# EAGLE design blinker_schematic (EAGLE 7.4.0)
Blinkersteuerung
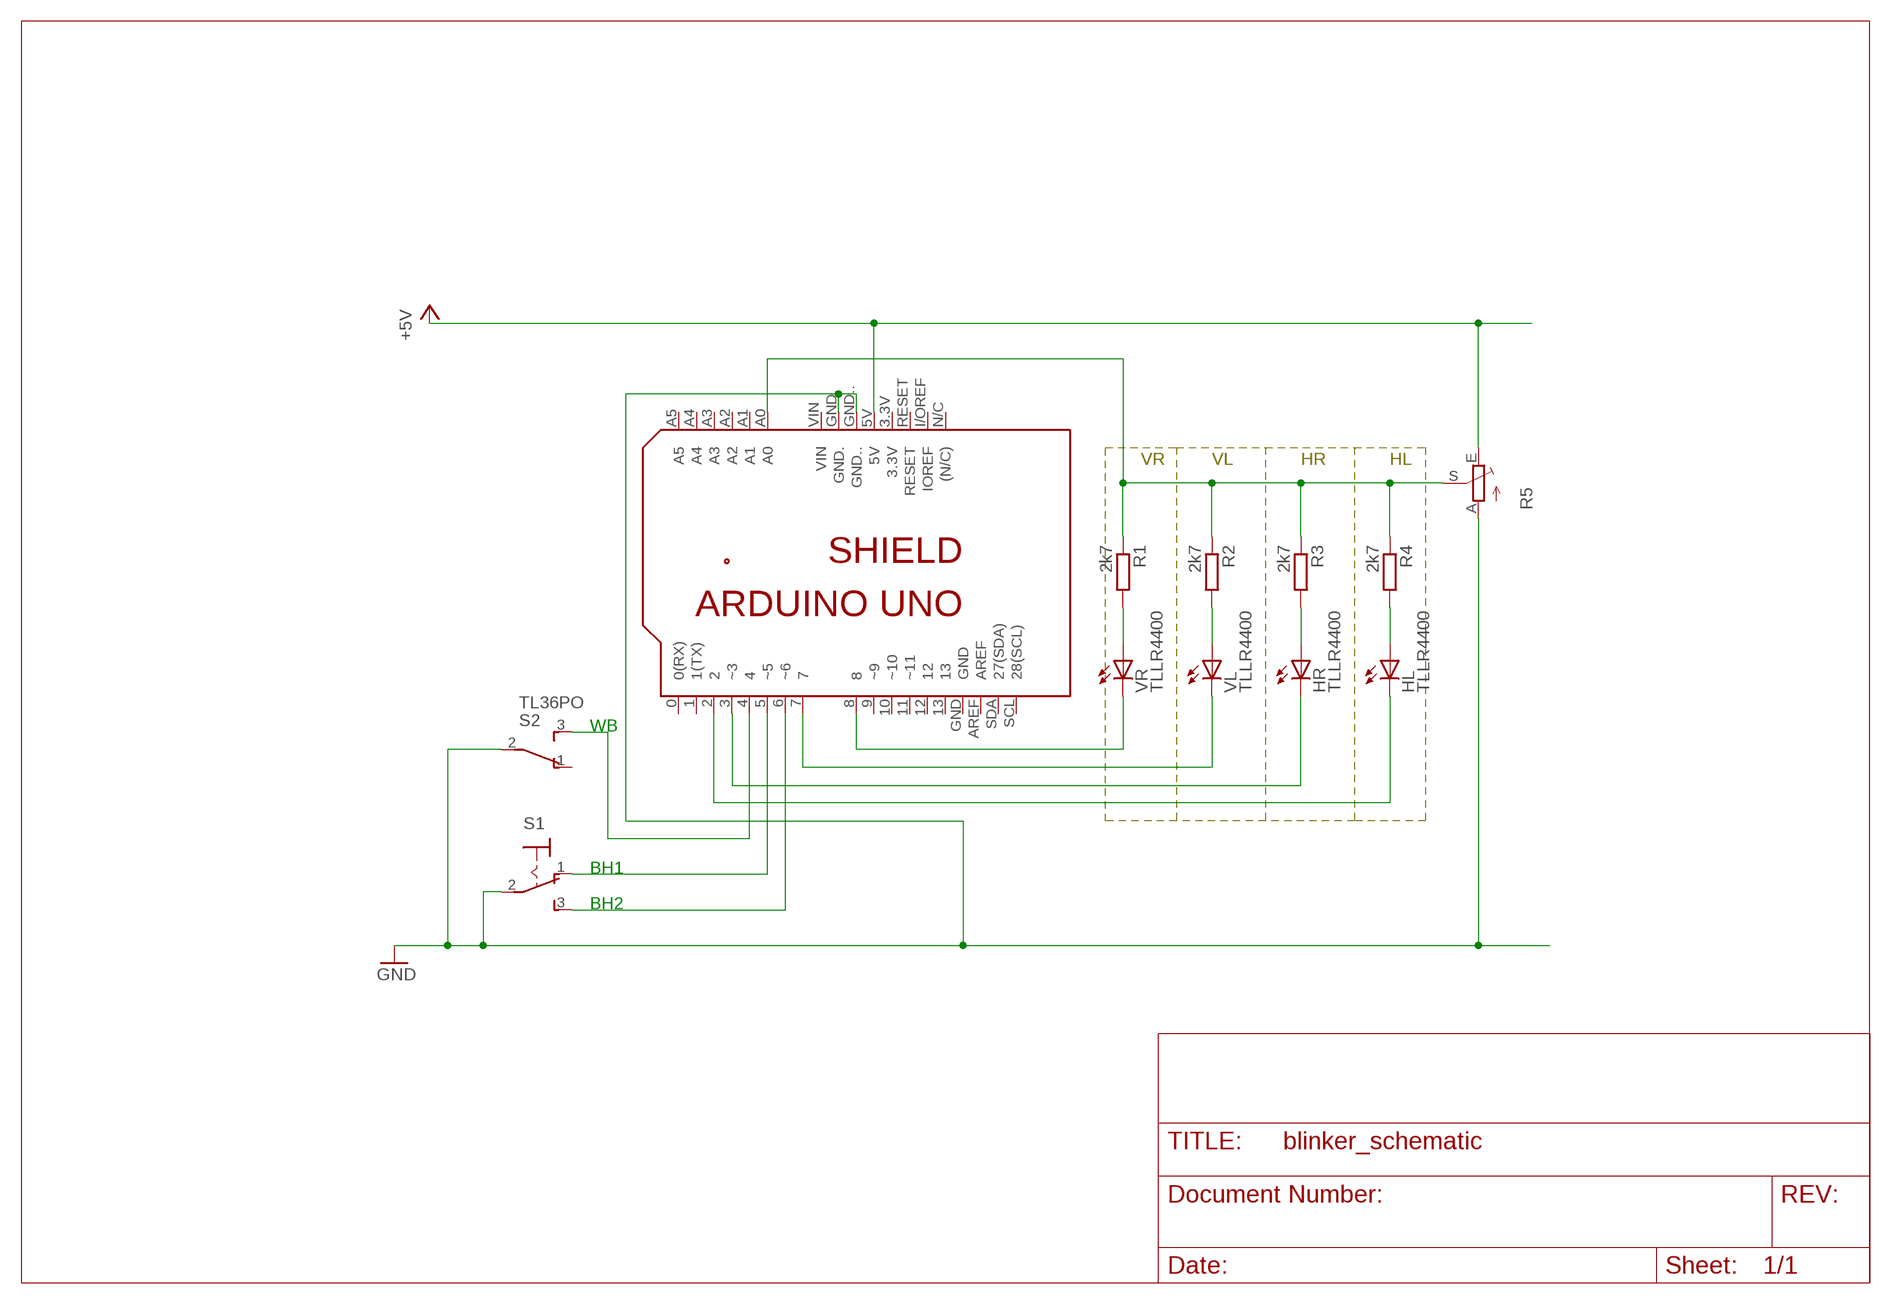
[diagram p0: schematic, sheet 1]

## Parts
HL  TLLR4400  [LED3MM]
HR  TLLR4400  [LED3MM]
PCB1  ARDUINO_UNO  [ARDUINO_UNO]
R1  2k7  R-EU_0207/12  [0207/12]
R2  2k7  R-EU_0207/12  [0207/12]
R3  2k7  R-EU_0207/12  [0207/12]
R4  2k7  R-EU_0207/12  [0207/12]
R5  TRIM_EU-RS3  [RS3]
S1  M9040P  [M9040P]
S2  TL36PO  [TL3XPO]
VL  TLLR4400  [LED3MM]
VR  TLLR4400  [LED3MM]

## Nets
+5V: PCB1.5V R5.E
GND: PCB1.GND. PCB1.GND.. R5.A S1.2(P) S2.2(P)
N$1: PCB1.A0 R1.1 R2.1 R3.1 R4.1 R5.S
N$2: R1.2 VR.A
N$3: R2.2 VL.A
N$4: HR.A R3.2
N$5: HL.A R4.2
N$8: PCB1.8 VR.K(C)
N$9: PCB1.7 VL.K(C)
N$10: PCB1.6(~6) S1.3(S)
N$11: PCB1.5(~5) S1.1(O)
N$12: PCB1.4 S2.3(S)
N$13: HR.K(C) PCB1.3(~3)
N$14: HL.K(C) PCB1.2
Unconnected: PCB1.0(0(RX)) PCB1.1(1(TX)) PCB1.3.3V PCB1.9(~9) PCB1.10(~10) PCB1.11(~11) PCB1.12 PCB1.13 PCB1.A1 PCB1.A2 PCB1.A3 PCB1.A4 PCB1.A5 PCB1.AREF PCB1.GND PCB1.I/OREF(IOREF) PCB1.N/C((N/C)) PCB1.RESET PCB1.SCL(28(SCL)) PCB1.SDA(27(SDA)) PCB1.VIN S2.1(O)

## Notes on the sheet
- VR | VL | HR | HL
- WB
- BH1
- BH2

## Library data of the parts
HL HR VL VR = HSKA_SWEWS16:TLLR4400: Low Current (2mA) LED 3 mm Tinted Diffused Package color RED Source: Data sheet <http://www.farnell.com/datasheets/391100.pdf>; MF: VISHAY SEMICONDUCTOR; OC_FARNELL: 1612437
PCB1 = HSKA_SWEWS16:ARDUINO_UNO: Device for representing an Arduino Uno board with a footprint in an EAGLE design. Created by Dave Young for Element14. More EAGLE documentation at: http://www.element14.com/community/community/knode/cadsoft_eagle
R1-R4 = HSKA_SWEWS16:R-EU_: RESISTOR, European symbol
R5 = HSKA_SWEWS16:TRIM_EU-: POTENTIOMETER
S1 = HSKA_SWEWS16:M9040P: TOGGLE SWITCH Marquardt
S2 = HSKA_SWEWS16:TL36PO: TINY SWITCH ON - ON Source: http://www2.produktinfo.conrad.com/datenblaetter/700000-724999/705152-da-01-de-Subminiaturschalter_TL_36YO.pdf

## Board
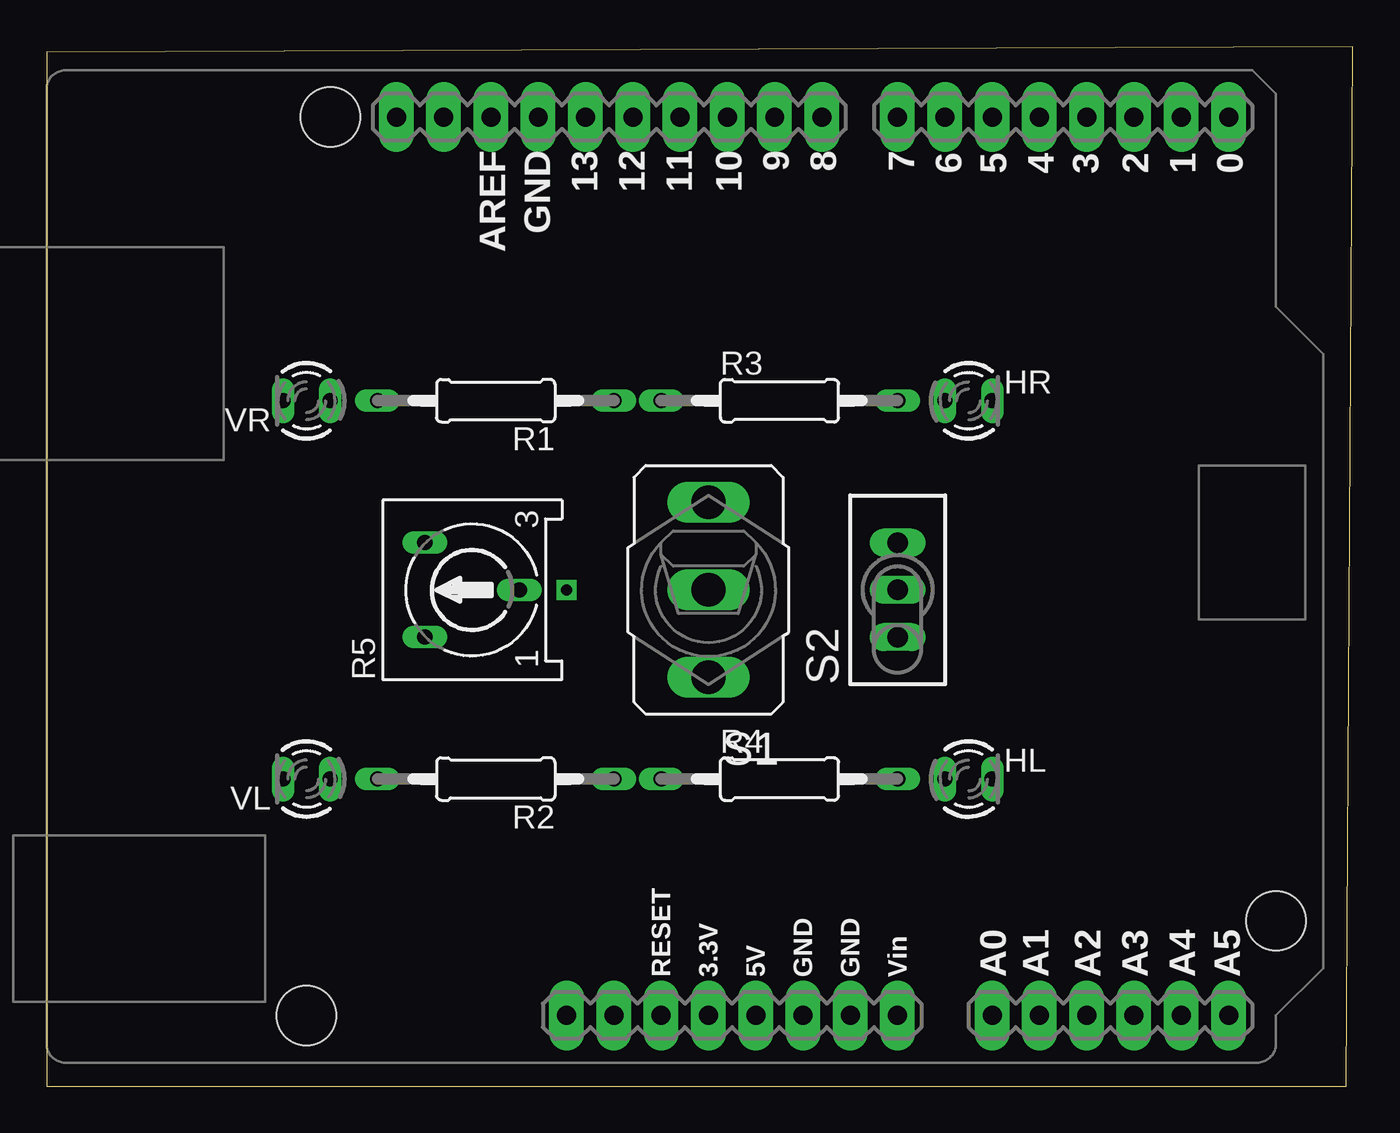
[diagram p1: board, top side]
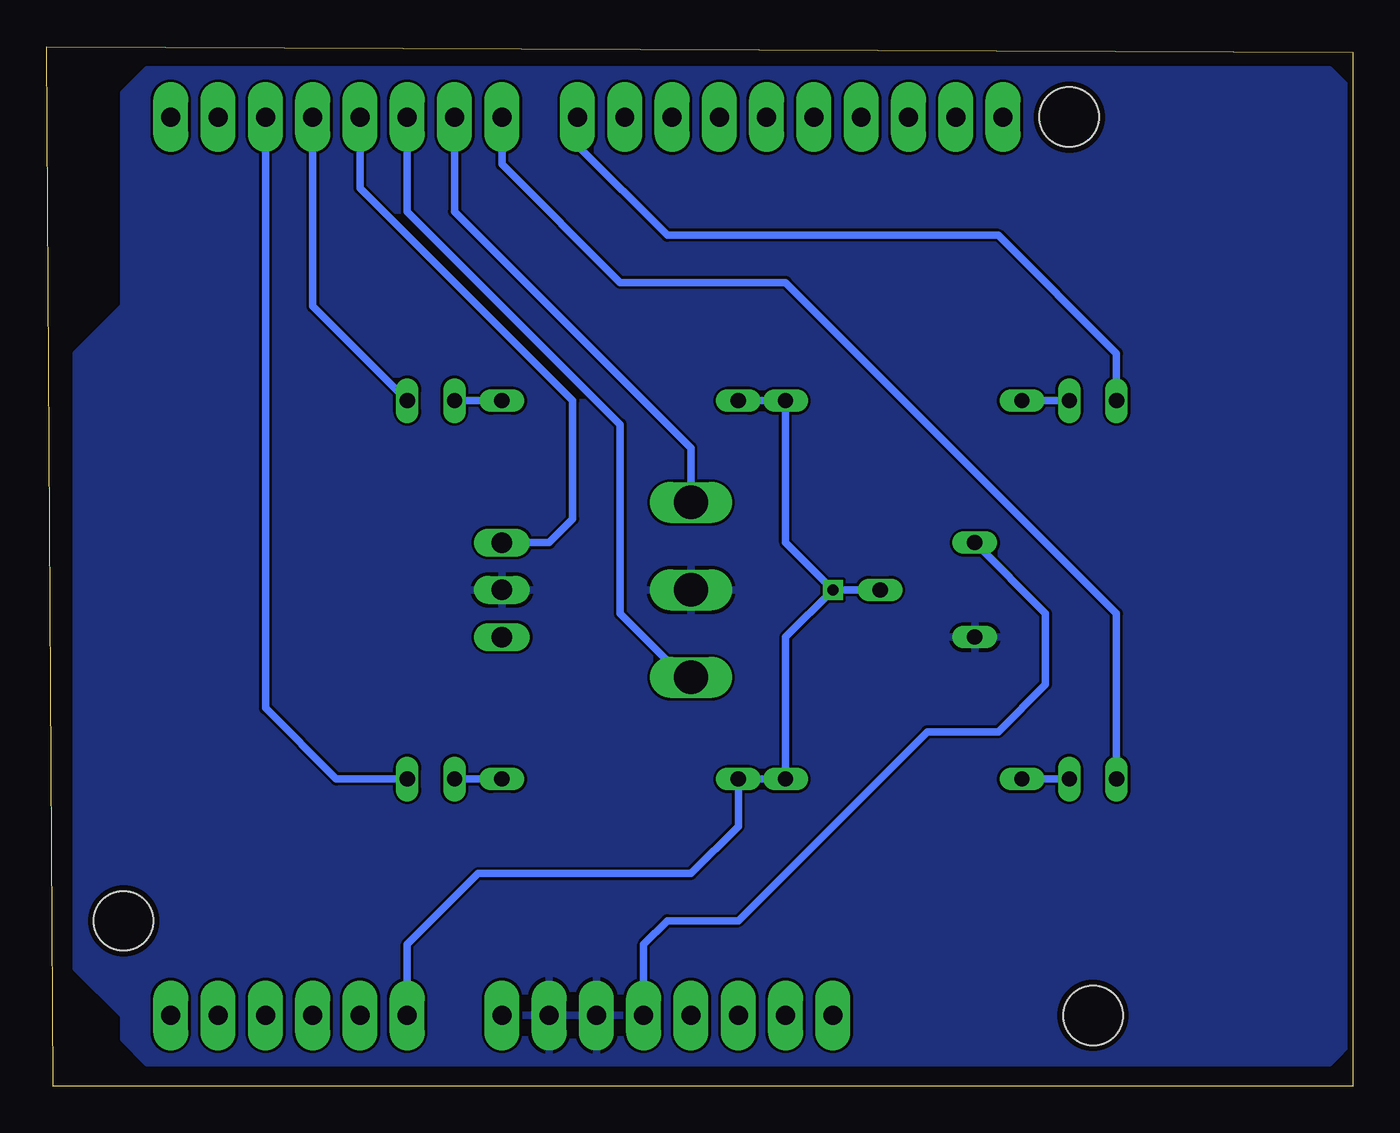
[diagram p2: board, bottom side, seen from below]

Size 70.18 x 55.86 mm. Coordinates in mm from the lower left corner, seen from the top.
Outline: 0,0 69.83,0 70.18,55.86 0,55.55 0,0
Copper layers (1*16): Top 0.035mm / dielectric 1.5mm / Bottom 0.035mm
Design rules "PCB-POOL Standard": minimum track width 0.15mm, minimum drill 0.3mm, track to track 0.15mm, track to pad 0.15mm, pad to pad 0.15mm, via to via 0.15mm, smd to smd 0.15mm, copper to edge 0.3mm, drill to drill 0.2mm, minimum pad ring 0.2mm, minimum via ring 0.15mm, stop-mask expansion 0.075mm, vias tented up to drill 0mil, thermal gap 0.2mm

### Footprints (pad centres in the part's own frame; a part is rotated, then mirrored left to right if it is on the bottom)
LED3MM = drill 0.813 long: A -1.27,0; K 1.27,0
ARDUINO_UNO = drill 1.016 pad 1.88 long: 0 63.5,50.8; 1 60.96,50.8; 2 58.42,50.8; 3 55.88,50.8; 3.3V 35.56,2.54; 4 53.34,50.8; 5 50.8,50.8; 5V 38.1,2.54; 6 48.26,50.8; 7 45.72,50.8; 8 41.656,50.8; 9 39.116,50.8; 10 36.576,50.8; 11 34.036,50.8; 12 31.496,50.8; 13 28.956,50.8; A0 50.8,2.54; A1 53.34,2.54; A2 55.88,2.54; A3 58.42,2.54; A4 60.96,2.54; A5 63.5,2.54; AREF 23.876,50.8; GND 26.416,50.8; GND. 43.18,2.54; GND.. 40.64,2.54; I/OREF 30.48,2.54; N/C 27.94,2.54; RESET 33.02,2.54; SCL 18.796,50.8; SDA 21.336,50.8; VIN 45.72,2.54 | hole 3.2: 66.04,7.62; 15.24,50.8; 13.97,2.54
0207/12 = drill 0.813 long: 1 -6.35,0; 2 6.35,0
RS3 = drill 0.813 long: A -2.54,2.54; E 2.54,2.54; S 0,-2.54
M9040P = drill 1.803 long: 1 0,4.699; 2 0,0; 3 0,-4.699
TL3XPO = drill 1.1 pad 1.422 long: 1 -2.54,0; 2 0,0; 3 2.54,0

### Placement (x,y rotation side)
HL  49.53,16.51 0 top
HR  49.53,36.83 0 top
PCB1  0,1.27 0 top
R1  24.13,36.83 180 top
R2  24.13,16.51 180 top
R3  39.37,36.83 0 top
R4  39.37,16.51 0 top
R5  22.86,26.67 90 top
S1  35.56,26.67 180 top
S2  45.72,26.67 90 top
VL  13.97,16.51 180 top
VR  13.97,36.83 180 top

### Tracks (layer width: path | path; a pad name or v marks a point on that pad's centre or on a via)
+5V
  Bottom 0.406: R5.E 16.51,25.4 16.51,21.59 19.05,19.05 22.86,19.05 33.02,8.89 36.83,8.89 38.1,7.62 PCB1.5V
GND
  pour Bottom: 1.27,1.27 64.77,1.27 66.04,2.54 66.04,3.81 68.58,6.35 68.58,39.37 66.04,41.91 66.04,53.34 64.77,54.61 1.27,54.61 0,53.34 0,2.54
N$1  (via drill 0.6)
  Bottom 0.406: R3.1 R1.1 30.48,29.21 v27.94,26.67 | R5.S v27.94,26.67 | PCB1.A0 50.8,7.62 46.99,11.43 35.56,11.43 33.02,13.97 R4.1 R2.1 30.48,24.13 v27.94,26.67
N$2
  Bottom 0.406: VR.A R1.2
N$3
  Bottom 0.406: VL.A R2.2
N$4
  Bottom 0.406: R3.2 HR.A
N$5
  Bottom 0.406: HL.A R4.2
N$8
  Bottom 0.406: VR.K 12.7,39.37 19.05,45.72 36.83,45.72 41.66,50.55 PCB1.8
N$9
  Bottom 0.406: VL.K 12.7,25.4 30.48,43.18 39.37,43.18 45.72,49.53 PCB1.7
N$10
  Bottom 0.406: S1.3 35.56,34.29 48.26,46.99 PCB1.6
N$11
  Bottom 0.406: PCB1.5 50.8,46.99 39.37,35.56 39.37,25.4 35.94,21.97 S1.1
N$12
  Bottom 0.406: PCB1.4 53.34,48.26 41.91,36.83 41.91,30.48 43.18,29.21 S2.3
N$13
  Bottom 0.406: PCB1.3 55.88,41.91 HR.K
N$14
  Bottom 0.406: HL.K 54.61,16.51 58.42,20.32 PCB1.2